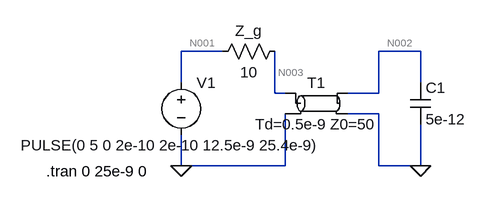
[diagram p0: schematic Problem 6.asc]
Problem 6.asc, the LTspice schematic file:
Version 4
SHEET 1 964 680
WIRE 128 -32 64 -32
WIRE 432 -32 368 -32
WIRE 64 16 64 -32
WIRE 432 16 432 -32
WIRE 208 32 208 -32
WIRE 224 32 208 32
WIRE 368 32 368 -32
WIRE 368 32 320 32
WIRE 368 64 320 64
WIRE 64 144 64 96
WIRE 224 144 224 64
WIRE 224 144 64 144
WIRE 368 144 368 64
WIRE 432 144 432 80
WIRE 432 144 368 144
FLAG 64 144 0
FLAG 432 144 0
SYMBOL voltage 64 0 R0
WINDOW 3 -247 112 Left 2
WINDOW 123 0 0 Left 0
WINDOW 39 0 0 Left 0
SYMATTR Value PULSE(0 5 0 2e-10 2e-10 12.5e-9 25.4e-9)
SYMATTR InstName V1
SYMBOL res 224 -48 R90
WINDOW 0 0 56 VBottom 2
WINDOW 3 32 56 VTop 2
SYMATTR InstName Z_g
SYMATTR Value 10
SYMBOL tline 272 48 R0
SYMATTR InstName T1
SYMATTR Value Td=0.5e-9 Z0=50
SYMBOL cap 416 16 R0
SYMATTR InstName C1
SYMATTR Value 5e-12
TEXT -144 152 Left 2 !.tran 0 25e-9 0

The netlist it stands for:
* Problem 6.asc
V1 N001 0 PULSE(0 5 0 2e-10 2e-10 12.5e-9 25.4e-9)
R§Z_g N003 N001 10
T1 N003 0 N002 0 Td=0.5e-9 Z0=50
C1 N002 0 5e-12
.tran 0 25e-9 0
.backanno
.end

* Results of the author's LTspice run, read from the files saved beside the schematic
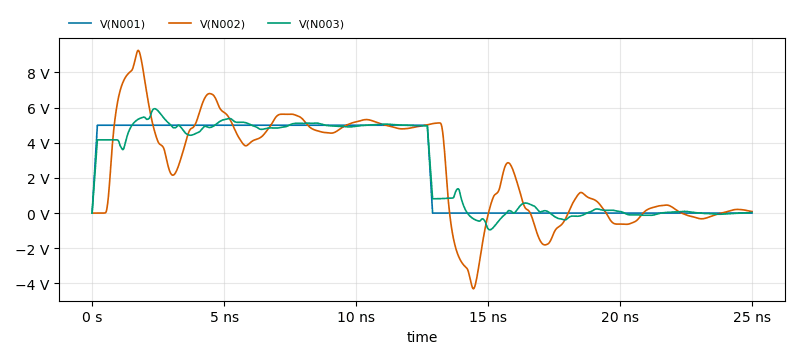
[diagram p1: Transient Analysis of Problem 6.asc, plotted from the saved traces]
* Transient Analysis, 1 run:
*   V(N001): min 0 V, max 5 V, average 2.54 V, rms 3.559 V, last 0 V
*   V(N002): min -4.307 V, max 9.259 V, average 2.542 V, rms 3.874 V, last 88.93 mV
*   V(N003): min -948.7 mV, max 5.941 V, average 2.539 V, rms 3.538 V, last 37.2 mV